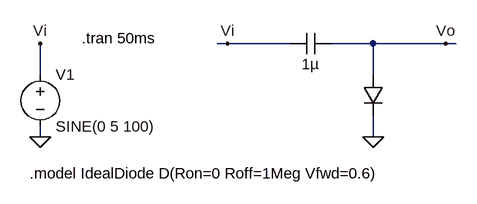
[diagram p0: schematic C-Dp.asc]
C-Dp.asc, the LTspice schematic file:
Version 4
SHEET 1 880 680
WIRE 0 128 -16 128
WIRE 96 128 0 128
WIRE 224 128 160 128
WIRE 336 128 224 128
WIRE 352 128 336 128
WIRE -288 176 -288 128
WIRE 224 176 224 128
WIRE -288 272 -288 256
WIRE 224 272 224 240
FLAG 224 272 0
FLAG 0 128 Vi
FLAG 336 128 Vo
FLAG -288 272 0
FLAG -288 128 Vi
SYMBOL cap 160 112 R90
WINDOW 0 0 32 Invisible 2
WINDOW 3 32 32 VTop 2
SYMATTR InstName C1
SYMATTR Value 1µ
SYMBOL voltage -288 160 R0
WINDOW 123 0 0 Left 0
WINDOW 39 0 0 Left 0
SYMATTR InstName V1
SYMATTR Value SINE(0 5 100)
SYMBOL diode 208 176 R0
WINDOW 0 24 0 Invisible 2
WINDOW 3 24 64 Invisible 2
SYMATTR InstName D1
SYMATTR Value IdealDiode
TEXT -224 120 Left 2 !.tran 50ms
TEXT -304 328 Left 2 !.model IdealDiode D(Ron=0 Roff=1Meg Vfwd=0.6)

The netlist it stands for:
* C-Dp.asc
C1 Vo Vi 1µ
V1 Vi 0 SINE(0 5 100)
D1 Vo 0 IdealDiode
.model D D
.lib standard.dio
.tran 50ms
.model IdealDiode D(Ron=0 Roff=1Meg Vfwd=0.6)
.backanno
.end